# EAGLE design wifiswitch (EAGLE 7.7.0)
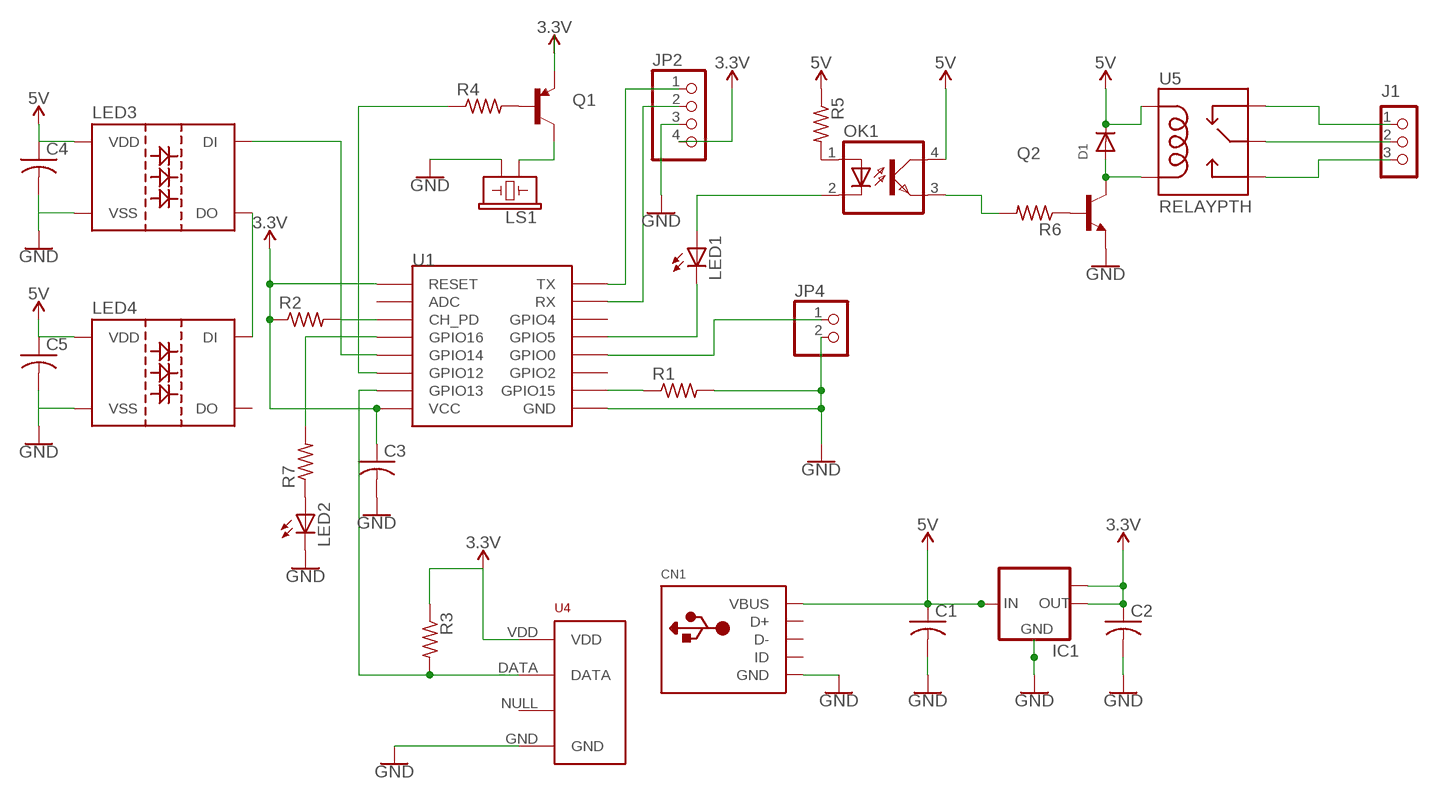
[diagram p0: schematic, sheet 1]

## Parts
C1  C-USC0805  [C0805]
C2  C-USC0805  [C0805]
C3  C-USC0805  [C0805]
C4  C-USC0805  [C0805]
C5  C-USC0805  [C0805]
CN1  USBTHM  [USB-MINIB-THM]
D1  DIODESOD-123  [SOD-123]
IC1  LM1117IMPX-3.3  [SOT223]
J1  CON_TERMINAL_BLOCK_03-5MM  [TERMINAL_BLOCK_3P_5]
JP2  PINHD-1X4  [1X04]
JP4  PINHD-1X2  [1X02]
LED1  LEDCHIP-LED0805  [CHIP-LED0805]
LED2  LEDCHIP-LED0805  [CHIP-LED0805]
LED3  WS2812B  [WS2812B]
LED4  WS2812B  [WS2812B]
LS1  BUZZER-PTH  [BUZZER-12MM]
OK1  PC817  [DIL04]
Q1  TRANSISTOR_PNPPMBT3906  [SOT23-3]
Q2  TRANSISTOR_BJT_NPN-SOT-23-BEC  [SOT-23]
R1  R-US_R0805  [R0805]
R2  R-US_R0805  [R0805]
R3  R-US_R0805  [R0805]
R4  R-US_R0805  [R0805]
R5  R-US_R0805  [R0805]
R6  R-US_R0805  [R0805]
R7  R-US_R0805  [R0805]
U1  ESP12SMD  [ESP12-SMD]
U4  RHT03_DHT-22_AM2302RA  [RHT03_DHT-22/RA]
U5  RELAYPTH  [SRD-05VDC-SL-C]

## Nets
3.3V: C2.1 C3.1 IC1.2(OUT) IC1.TAB(OUT1) JP2.4 Q1.2(E) R2.1 R3.1 U1.RESET U1.VCC U4.VDD
5V: C1.1 C4.1 C5.1 CN1.VBUS D1.C IC1.3(IN) LED3.1(VDD) LED4.1(VDD) OK1.4(COL) R5.1 U5.P$1(COIL1)
GND: C1.2 C2.2 C3.2 C4.2 C5.2 CN1.GND IC1.1(GND) JP2.3 JP4.2 LED2.C LED3.3(VSS) LED4.3(VSS) LS1.- Q2.2(E) R1.2 U1.GND U4.GND
N$1: LS1.+ Q1.3(C)
N$2: R1.1 U1.GPIO15
N$3: LED3.4(DI) U1.GPIO14
N$4: R4.1 U1.GPIO12
N$5: R3.2 U1.GPIO13 U4.DATA
N$6: LED2.A R7.1
N$7: LED1.A OK1.2(C)
N$8: JP2.1 U1.TXD0(TX)
N$9: JP4.1 U1.GPIO0
N$10: Q2.1(B) R6.1
N$11: JP2.2 U1.RXD0(RX)
N$12: R2.2 U1.CH_PD
N$13: Q1.1(B) R4.2
N$14: OK1.1(A) R5.2
N$15: D1.A Q2.3(C) U5.P$4(COIL0)
N$16: J1.1 U5.P$5(SWCLOSE)
N$17: J1.2 U5.P$3(SWCOMMON)
N$18: J1.3 U5.P$2(SWOPEN)
N$19: OK1.3(EMIT) R6.2
N$20: LED1.C U1.GPIO5
N$21: LED3.2(DO) LED4.4(DI)
N$22: R7.2 U1.GPIO16
Unconnected: CN1.D+ CN1.D- CN1.ID LED4.2(DO) U1.ADC U1.GPIO2 U1.GPIO4 U4.NULL

## Library data of the parts
C1 C2 = adafruit:C-US: CAPACITOR, American symbol; OC_NEWARK: unknown
C3-C5 = adafruit:C-US: CAPACITOR, American symbol; MPN: C0805X104J5RAC3316; OC_NEWARK: 01AC1592
CN1 = adafruit:USB: USB Connectors USBMINIB - Surface Mount Female Mini-B USB Connector 4UConnector: 06564 By microbuilder.eu Thru-hole RA Female Mini-B USB Connector 4UConnector: 18732 By ladyada.net
D1 = adafruit:DIODE: Diode SMADIODE - SMA Surface Mount Package 20V 1A Schottky Diode Digikey: 641-1014-6-ND DO-1N4148 - Through Hole Small Current Diode SOD-123 20V 1 A (.5mV Vf) Schottky Diode - Digikey: MBRX120TPMSCT-ND SOD-323 10V 570mA (.38mV Vf, 3ns) Schottky Diode - Digikey: ZLLS410CT-ND SOD-523 30V 30mA Schottky Diode (RB751S-40TE61) - Digikey: RB751S-40TE61CT-ND SOT23-R/W - SOT23 Package (R = Solder Paste/Reflow Ovens, W = Hand-Soldering) BAT54Film 40V 300mA - Digikey: 497-7162-1-ND
IC1 = lm1117:LM1117IMPX-*; MPN: ADP3339AKCZ-3.3-R7; OC_NEWARK: 82Y9723
J1 = dp_devices:CON_TERMINAL_BLOCK_03: 3 poles, wire to board connector
JP2 = pinhead:PINHD-1X4: PIN HEADER; OC_NEWARK: unknown
JP4 = pinhead:PINHD-1X2: PIN HEADER; OC_NEWARK: unknown
LED1 LED2 = adafruit:LED: LED OSRAM: - CHIPLED LG R971, LG N971, LY N971, LG Q971, LY Q971, LO R971, LY R971 LH N974, LH R974 LS Q976, LO Q976, LY Q976 LO Q996 - Hyper CHIPLED LW Q18S LB Q993, LB Q99A, LB R99A - SideLED LS A670, LO A670, LY A670, LG A670, LP A670 LB A673, LV A673, LT A673, LW A673 LH A674 LY A675 LS A676, LA A676, LO A676, LY A676, LW A676 LS A679, LY A679, LG A679 - Hyper Micro SIDELED® LS Y876, LA Y876, LO Y876, LY Y876 LT Y87S - SmartLED LW L88C, LW L88S LB L89C, LB L89S, LG L890 LS L89K, LO L89K, LY L89K LS L896, LA L896, LO L896, LY L896 - TOPLED LS T670, LO T670, LY T670, LG T670, LP T670 LSG T670, LSP T670, LSY T670, LOP T670, LYG T670 LG T671, LOG T671, LSG T671 LB T673, LV T673, LT T673, LW T673 LH T674 LS T676, LA T676, LO T676, LY T676, LB T676, LH T676, LSB T676, LW T676 LB T67C, LV T67C, LT T67C, LS T67K, LO T67K, LY T67K, LW E67C LS E67B, LA E67B, LO E67B, LY E67B, LB E67C, LV E67C, LT E67C LW T67C LS T679, LY T679, LG T679 LS T770, LO T770, LY T770, LG T770, LP T770 LB T773, LV T773, LT T773, LW T773 LH T774 LS E675, LA E675, LY E675, LS T675 LS T776, LA T776, LO T776, LY T776, LB T776 LHGB T686 LT T68C, LB T68C - Hyper Mini TOPLED® LB M676 - Mini TOPLED Santana® LG M470 LS M47K, LO M47K, LY M47K Source: http://www.osram.convergy.de/; OC_NEWARK: unknown
LED3 LED4 = WS2812B:WS2812B
LS1 = SparkFun-Electromechanical:BUZZER: Buzzer Small round buzzers that operate around the audible 2kHz range. You can use these as speakers to create simple music or user interfaces. Variant Overview: PTH - Mini Speaker - PC Mount 12mm 2.048kHz <https://www.sparkfun.com/products/7950> PTH_KIT - Mini Speaker - PC Mount 12mm 2.048kHz <https://www.sparkfun.com/products/7950> KIT simplifies soldering by adding stop mask to one side of the pads. PTH_NO_SILK - Mini Speaker - PC Mount 12mm 2.048kHz <https://www.sparkfun.com/products/7950> No silkscreen indicator of buzzer outline. PTH_KIT_NO_SILK - Mini Speaker - PC Mount 12mm 2.048kHz <https://www.sparkfun.com/products/7950> KIT package w/o silkscreen SMD - Buzzer Audio Magnetic (CCV-084B16) SMD buzzer used on, e.g. the LilyPad Buzzer <https://www.sparkfun.com/products/8463> and RFID USB Reader <https://www.sparkfun.com/products/9963>. SMD_KIT - Buzzer Audio Magnetic (CCV-084B16) SMD Buzzer with elongated pins to make soldering easier. Used on the SparkFun Simon Says - Surface Mount Soldering Kit <https://www.sparkfun.com/products/10935>.; PROD_ID: COMP-08253; SF_SKU: COM-07950
OK1 = optocoupler:PC817: SHARP OPTO COUPLER; MPN: PC817X4J000F; OC_FARNELL: 9707727; OC_NEWARK: 97K7059
Q1 = User-Submitted:TRANSISTOR_PNP: Generic PNP BJT Double check pinouts against datasheets- not all devices are the same! MMBT3906 - 40V 200mA SOT-23 (TRANS-08052) MMBT4403 - 40V 600mA SOT-23 (TRANS-09245); PROD_ID: TRANS-08052; VALUE: PMBT3906
Q2 = dp_devices:TRANSISTOR_BJT_NPN: Most commonly used is SOT23-BEC
R1-R7 = adafruit:R-US_: RESISTOR, American symbol; OC_NEWARK: unknown
U1 = esp8266modules:ESP12: ESP8266 Wifi module 12
U4 = dht22:RHT03_DHT-22_AM2302: RHT03 / DHT-22 / AM2302 Packages and symbol for the RHT03 / DHT-22 relative humidity and temperature sensor. Note: The AM2302 is a wired version of the DHT-22 which typically requires less clearance and is thus provided as a separate package.; PROD_ID: SEN-10167
U5 = SRD-05VDC-SL-C - Lee:RELAY: SPDT relay (COM-00101)

## Net classes
0 default: width 0.305 mm, drill 0.508 mm, clearance 0.254 mm

## Board
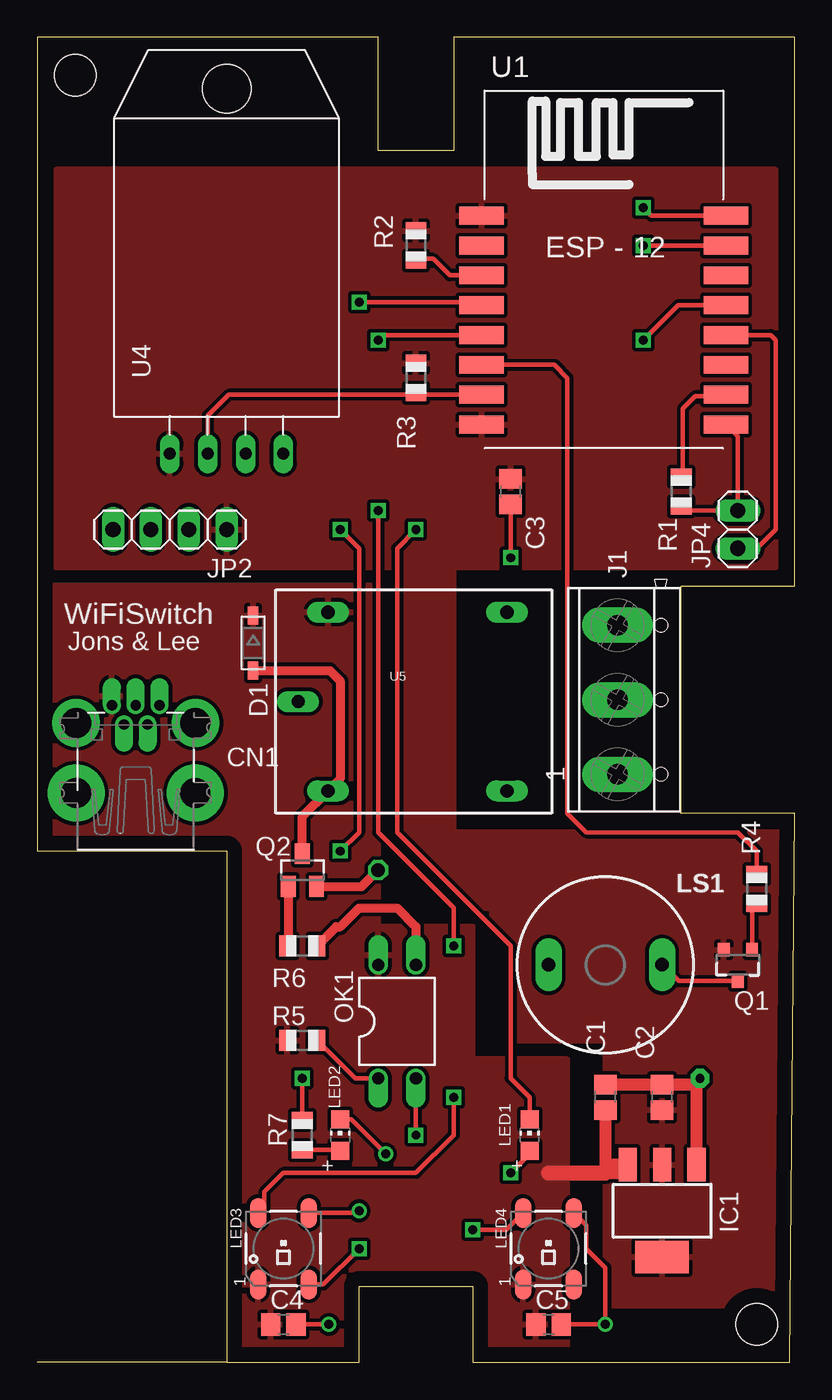
[diagram p1: board, top side]
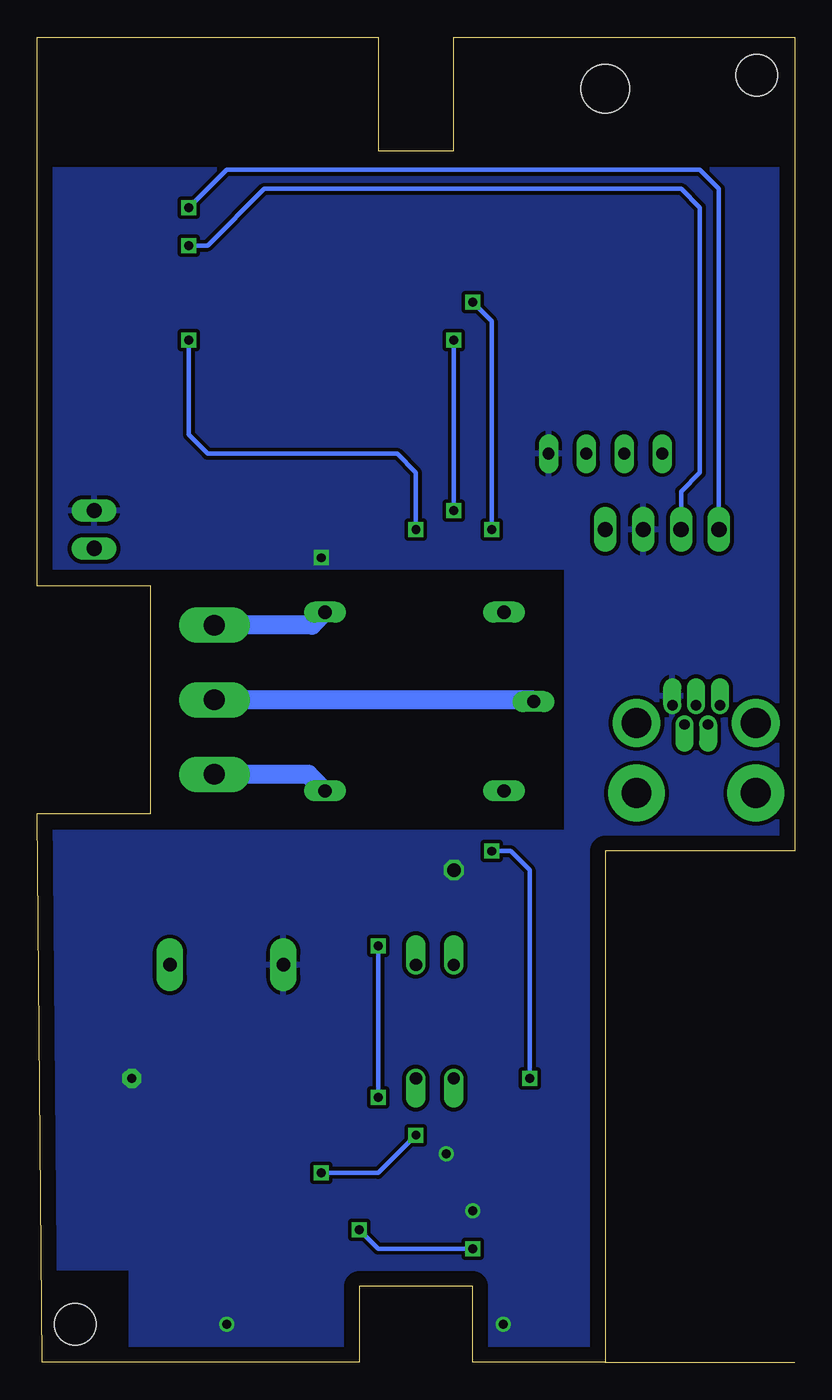
[diagram p2: board, bottom side, seen from below]

Size 50.8 x 88.9 mm. Coordinates in mm from the lower left corner, seen from the top.
Outline: 12.7,0 21.59,0 21.59,5.08 29.21,5.08 29.21,0 50.47,0 50.8,36.83 43.18,36.83 43.18,52.07 50.8,52.07 50.8,88.89 50.47,88.89 27.94,88.9 27.94,81.28 22.86,81.28 22.86,88.89 0,88.89 0,34.29 12.7,34.29 12.7,0
Outline: 12.7,0 0,0
Copper layers (1*16): Top 0.035mm / dielectric 1.5mm / Bottom 0.035mm
Design rules "default": minimum track width 10mil, minimum drill 24mil, track to track 8mil, track to pad 8mil, pad to pad 8mil, via to via 8mil, smd to smd 8mil, copper to edge 40mil, drill to drill 8mil, minimum pad ring 10mil, minimum via ring 8mil, stop-mask expansion 4mil, vias tented up to drill 0mil, thermal gap 10mil
Holes 2.8 mm at 2.54,86.36 48.26,2.54

### Footprints (pad centres in the part's own frame; a part is rotated, then mirrored left to right if it is on the bottom)
C0805 = smd 1.3 x 1.5: 1 -0.85,0; 2 0.85,0
USB-MINIB-THM = drill 0.7 offset: D+ 0,9.8; D- -0.8,8.5; GND 1.6,9.8; ID 0.8,8.5; VBUS -1.6,9.8 | drill 2 pad 3.81: GND1 -4,3.9; GND4 4,3.9 | drill 2 pad 3.2: GND2 -4,8.6; GND3 4,8.6
SOD-123 = smd 1.2 x 0.7: A 1.85,0; C -1.85,0
SOT223 = smd 1.219 x 2.235: 1 -2.311,-3.099; 2 0,-3.099; 3 2.311,-3.099 | smd 3.6 x 2.2: TAB 0,3.099
TERMINAL_BLOCK_3P_5 = drill 1.4 pad 2.38 long: 1 5,-0.45; 2 0,-0.45; 3 -5,-0.45
1X04 = drill 1.016 long: 1 -3.81,0; 2 -1.27,0; 3 1.27,0; 4 3.81,0
1X02 = drill 1.016 long: 1 -1.27,0; 2 1.27,0
CHIP-LED0805 = smd 1.2 x 1.2: A 0,-1.05; C 0,1.05
WS2812B = smd 2 x 1.1: 1 -2.4,1.7; 2 -2.4,-1.7; 3 2.4,-1.7; 4 2.4,1.7
BUZZER-12MM = drill 0.9 pad 1.778 long: + 3.81,0; - -3.81,0
DIL04 = drill 0.813 offset: 1 -1.27,-3.81; 2 1.27,-3.81; 3 1.27,3.81; 4 -1.27,3.81
SOT23-3 = smd 0.8 x 0.9: 1 -0.95,-1; 2 0.95,-1; 3 0,1.1
SOT-23 = smd 1 x 1.4: 1 -0.95,-1.1; 2 0.95,-1.1; 3 0,1.1
R0805 = smd 1.1 x 1.4: 1 -1,0; 2 1,0
ESP12-SMD = smd 3 x 1.2: ADC -8.3,3.8; CH_PD -8.3,1.8; GND 8.1,-8.2; GPIO0 8.1,-2.2; GPIO2 8.1,-4.2; GPIO4 8.1,1.8; GPIO5 8.1,-0.2; GPIO12 -8.3,-4.2; GPIO13 -8.3,-6.2; GPIO14 -8.3,-2.2; GPIO15 8.1,-6.2; GPIO16 -8.3,-0.2; RESET -8.3,5.8; RXD0 8.1,3.8; TXD0 8.1,5.8; VCC -8.3,-8.2
RHT03_DHT-22/RA = drill 0.8 long: DATA -1.27,0; GND 3.81,0; NULL 1.27,0; VDD -3.81,0 | hole 3.25: 0,24.5
SRD-05VDC-SL-C = drill 0.9 long: P$1 -5.39,5.88; P$2 6.61,5.88; P$3 -7.39,-0.12; P$4 -5.39,-6.12; P$5 6.61,-6.12

### Placement (x,y rotation side)
C1  38.1,17.78 90 top
C2  41.91,17.78 90 top
C3  31.75,58.42 270 top
C4  16.51,2.54 0 top
C5  34.29,2.54 0 top
CN1  6.6,34.29 0 top
D1  14.48,48.26 270 top
IC1  41.91,10.16 180 top
J1  39.37,44.45 270 top
JP2  8.89,55.88 0 top
JP4  46.99,55.88 90 top
LED1  33.02,15.24 0 top
LED2  20.32,15.24 0 top
LED3  16.51,7.62 90 top
LED4  34.29,7.62 90 top
LS1  38.1,26.67 0 top
OK1  24.13,22.86 0 top
Q1  46.99,26.67 180 top
Q2  17.78,33.02 0 top
R1  43.18,58.42 270 top
R2  25.4,74.93 270 top
R3  25.4,66.04 270 top
R4  48.26,31.75 270 top
R5  17.78,21.59 0 top
R6  17.78,27.94 0 top
R7  17.78,15.24 90 top
U1  38.1,71.12 0 top
U4  12.7,60.96 0 top
U5  24.89,44.45 0 top

### Tracks (layer width: path | path; a pad name or v marks a point on that pad's centre or on a via)
3.3V
  pour Top: 50.8,3.81 50.8,35.56 27.94,35.56 27.94,53.34 49.53,53.34 49.53,80.01 1.27,80.01 1.27,53.34 24.13,53.34 24.13,30.48 30.48,30.48 30.48,21.59 38.1,21.59 38.1,3.81
5V
  Top 0.813: 38.66,13.26 IC1.3 39.37,13.03 39.37,12.7 38.1,12.7 C1.1
  Top 1.016: 34.29,12.7 38.1,12.7
  pour Top: -1.27,52.07 -1.27,-1.27 35.56,-1.27 35.56,20.32 29.21,20.32 29.21,29.21 22.86,29.21 22.86,52.07
GND  (via drill 0.6, 0.6 pad 1.27, 0.9)
  Top 0.305: 43.03,57.56 R1.2 43.45,57.15 JP4.2 46.99,62.13 U1.GND | v31.75,53.98 C3.2 | LED2.C 21.05,16.29 v23.37,13.97 | C4.2 v19.56,2.54 | LED3.3 21.45,10.02 v21.59,10.16 | LED4.3 36.83,9.18 36.83,7.62 38.1,6.35 v38.1,2.54 C5.2
  Top 0.61: Q2.2 21.76,31.92 v22.86,33.02
  Top 0.813: C1.2 C2.2 44.03,18.63 v44.45,19.05 44.22,18.82 IC1.1
  pour Bottom: -5.08,80.01 -5.08,-5.08 44.45,-5.08 44.45,6.35 53.34,6.35 53.34,7.62 53.34,35.56 15.24,35.56 15.24,53.34 53.34,53.34 53.34,80.01
N$1
  Top 0.305: LS1.+ 43.01,25.57 Q1.3
N$2
  Top 0.305: R1.1 43.31,59.51 43.31,63.98 44.15,64.82 46.1,64.82 U1.GPIO15
N$3  (via drill 0.6)
  Top 0.305: U1.GPIO14 23.2,68.92 v22.86,68.58 | v22.86,57.15 22.86,35.56 27.94,30.48 v27.94,27.94 | v27.94,17.78 27.94,15.24 25.4,12.7 16.51,12.7 15.24,11.43 15.24,10.45 LED3.4
  Bottom 0.305: v22.86,68.58 v22.86,57.15 | v27.94,27.94 v27.94,17.78
N$4
  Top 0.305: U1.GPIO12 34.68,66.92 35.56,66.04 35.56,36.83 36.83,35.56 46.99,35.56 48.26,34.29 R4.1
N$5
  Top 0.305: U4.DATA 11.43,63.5 12.85,64.92 U1.GPIO13 25.52,64.92 R3.2
N$6
  Top 0.305: LED2.A 20.27,14.24 R7.1
N$7  (via drill 0.6)
  Top 0.305: OK1.2 v25.4,15.24 | v31.75,12.7 33.02,13.97 LED1.A
  Bottom 0.305: v25.4,15.24 27.94,12.7 v31.75,12.7
N$8  (via drill 0.6)
  Top 0.305: U1.TXD0 41.19,76.92 v40.64,77.47
  Bottom 0.305: v40.64,77.47 38.1,80.01 6.35,80.01 5.08,78.74 JP2.1
N$9
  Top 0.305: U1.GPIO0 49.19,68.92 49.53,68.58 49.53,55.88 48.26,54.61 JP4.1
N$10
  Top 0.61: Q2.1 16.83,27.99 R6.1
N$11  (via drill 0.6)
  Top 0.305: U1.RXD0 v40.65,74.92 v40.64,74.93
  Bottom 0.305: v40.64,74.93 39.37,74.93 35.56,78.74 7.62,78.74 6.35,77.47 6.35,59.69 7.62,58.42 JP2.2
N$12
  Top 0.305: R2.2 25.43,74.04 26.54,74.04 27.66,72.92 29.62,72.92 U1.CH_PD
N$13
  Top 0.305: R4.2 47.94,30.43 Q1.1
N$14
  Top 0.305: R5.2 21.32,19.05 OK1.1
N$15
  Top 0.61: D1.A 19.63,46.41 20.32,45.72 20.32,39.15 U5.P$4 17.78,36.61 Q2.3
N$16
  Bottom 1.27: U5.P$5 32.62,39.45 J1.1
N$17
  Bottom 1.27: U5.P$3 17.62,44.45 J1.2
N$18
  Bottom 1.27: U5.P$2 32.38,49.45 J1.3
N$19
  Top 0.61: R6.2 20.05,29.21 20.32,29.21 21.59,30.48 24.13,30.48 25.4,29.21 OK1.3
N$20  (via drill 0.6)
  Top 0.305: 33.02,16.51 LED1.C 33.02,17.78 31.75,19.05 31.75,27.94 24.13,35.56 24.13,54.61 v25.4,55.88 | U1.GPIO5 42.98,70.92 v40.64,68.58
  Bottom 0.305: v40.64,68.58 40.64,62.23 39.37,60.96 26.67,60.96 25.4,59.69 v25.4,55.88
N$21  (via drill 0.6)
  Top 0.305: LED3.2 19.19,5.22 v21.59,7.62 | v29.21,8.89 31.46,8.89 LED4.4
  Bottom 0.305: v21.59,7.62 27.94,7.62 v29.21,8.89
N$22  (via drill 0.6)
  Top 0.305: U1.GPIO16 29.6,71.12 v21.59,71.12 | v20.32,55.88 21.59,54.61 21.59,35.56 v20.32,34.29 | v17.78,19.05 R7.2
  Bottom 0.305: v21.59,71.12 20.32,69.85 v20.32,55.88 | v20.32,34.29 19.05,34.29 17.78,33.02 v17.78,19.05

### Text on the board
tNames: WiFiSwitch | Jons & Lee | 1 | 1